# EasyEDA schematic 1-Schematic.json
TITLE: TL431 Shunt Regulator; REV: 1.0; Date: 2017-12-23; Sheet: 1/1; Drawn By: tardate
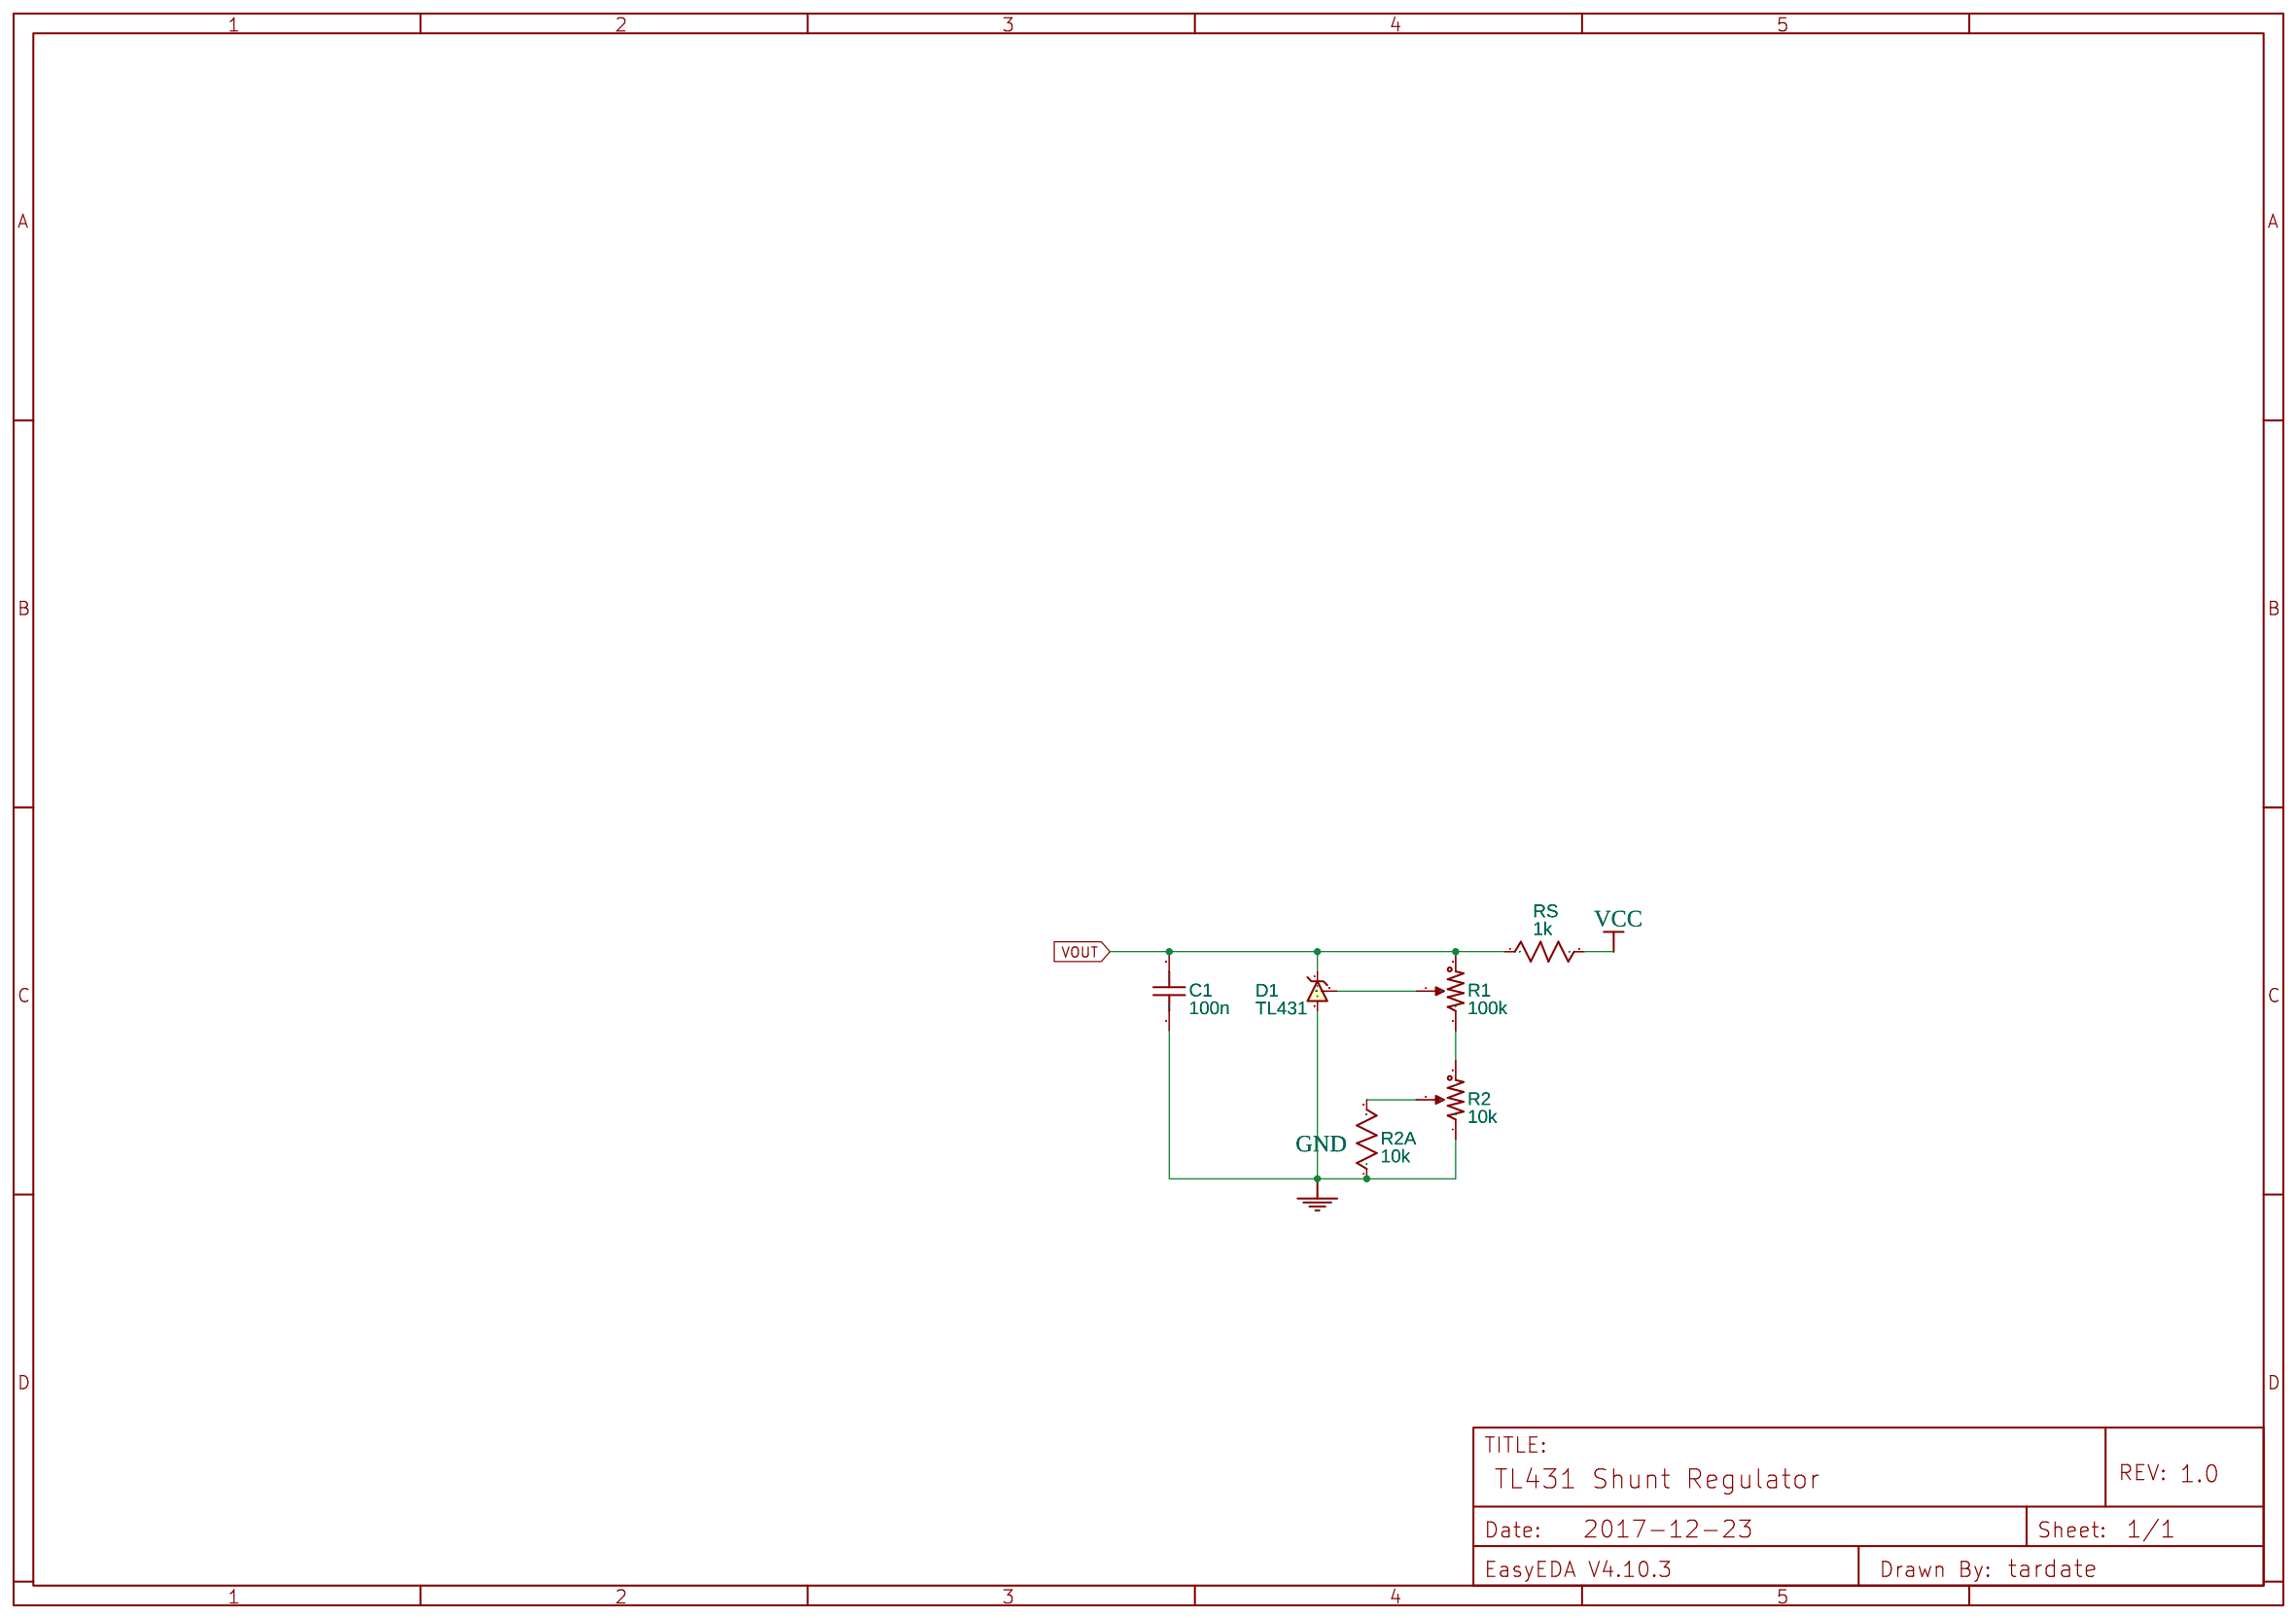
[diagram p0: schematic sheet]

## Parts
C1  100n  [RAD-0.1]
D1  TL431
R1  100k  [RES-ADJ_3386P]
R2  10k  [RES-ADJ_3386P]
R2A  10k  [AXIAL-0.3]
RS  1k  [AXIAL-0.3]

## Library data of the parts
C1 = Capacitor: Manufacturer Part: ?
D1 = -: catid: 20; Manufacturer Part: ?
R1 R2 = Potentiometer: K(%): 50; Manufacturer Part: ?
R2A RS = Resistor: Manufacturer Part: ?

## Nets
GND: C1.1 D1.2(A) R2.1 R2A.1
VCC: RS.2
VOUT: C1.2 D1.1(K) R1.3(2) RS.1
Net-(D1-3): D1.3(Ref) R1.2(3)
Net-(R1-1): R1.1 R2.3(2)
Net-(R2-2): R2.2(3) R2A.2
